# Altium schematic sheet MAX3232.SchDoc
size Letter; SheetNumber: 7; SheetTotal: 13
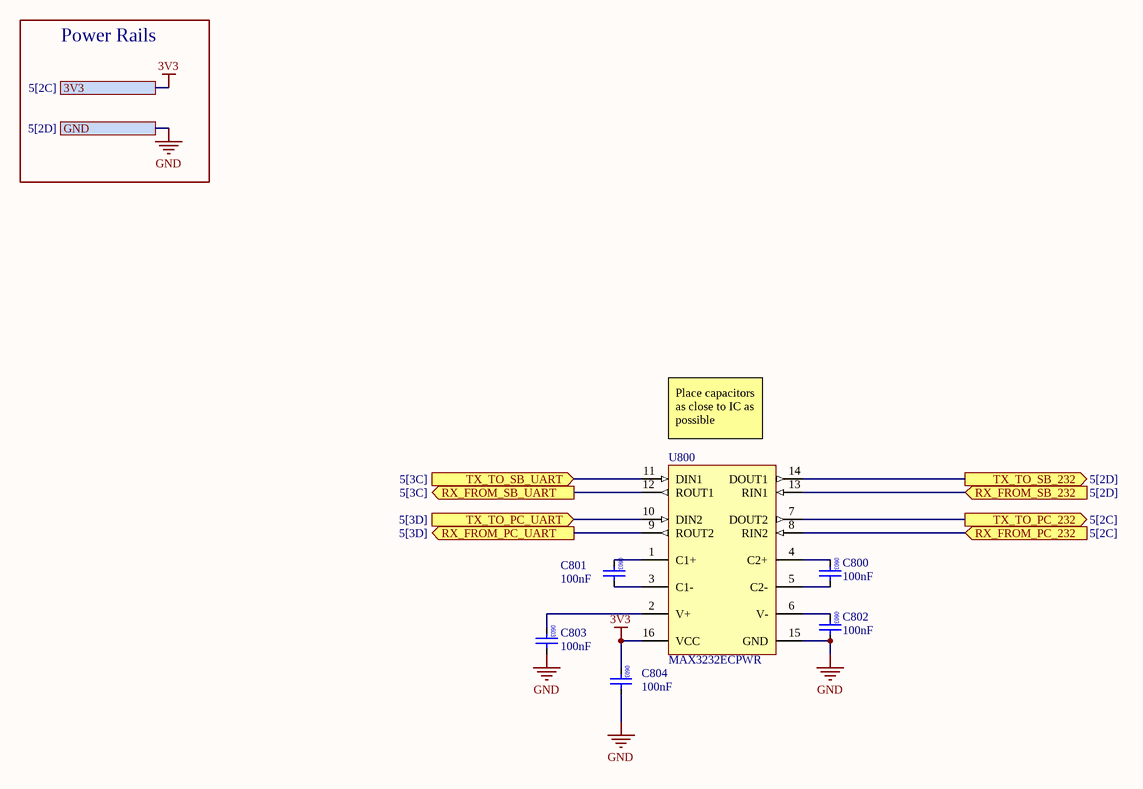
[diagram p0: MAX3232.SchDoc]

## Parts
C800  value 100nF  [0603 Capacitor Footprint]  (hidden comment: 0603 0.1uF 5% 50V)
C801  value 100nF  [0603 Capacitor Footprint]  (hidden comment: 0603 0.1uF 5% 50V)
C802  value 100nF  [0603 Capacitor Footprint]  (hidden comment: 0603 0.1uF 5% 50V)
C803  value 100nF  [0603 Capacitor Footprint]  (hidden comment: 0603 0.1uF 5% 50V)
C804  value 100nF  [0603 Capacitor Footprint]  (hidden comment: 0603 0.1uF 5% 50V)
U800  MAX3232ECPWR  [PW0016A_M]

## Ports
3V3 (see 5[2C]), GND (see 5[2D]), RX_FROM_PC_232 (in, see 5[2C]), RX_FROM_PC_UART (out, see 5[3D]), RX_FROM_SB_232 (in, see 5[2D]), RX_FROM_SB_UART (out, see 5[3C]), TX_TO_PC_232 (out, see 5[2C]), TX_TO_PC_UART (in, see 5[3D]), TX_TO_SB_232 (out, see 5[2D]), TX_TO_SB_UART (in, see 5[3C])

## Nets
3V3: C804.2 U800.16(VCC) ; port 3V3
GND: C802.1 C803.1 C804.1 U800.15(GND) ; port GND
RX_FROM_PC_232: U800.8(RIN2) ; port RX_FROM_PC_232
RX_FROM_PC_UART: U800.9(ROUT2) ; port RX_FROM_PC_UART
RX_FROM_SB_232: U800.13(RIN1) ; port RX_FROM_SB_232
RX_FROM_SB_UART: U800.12(ROUT1) ; port RX_FROM_SB_UART
TX_TO_PC_232: U800.7(DOUT2) ; port TX_TO_PC_232
TX_TO_PC_UART: U800.10(DIN2) ; port TX_TO_PC_UART
TX_TO_SB_232: U800.14(DOUT1) ; port TX_TO_SB_232
TX_TO_SB_UART: U800.11(DIN1) ; port TX_TO_SB_UART
NetC800_1: C800.1 U800.5(C2-)
NetC800_2: C800.2 U800.4(C2+)
NetC801_1: C801.1 U800.3(C1-)
NetC801_2: C801.2 U800.1(C1+)
NetC802_2: C802.2 U800.6(V-)
NetC803_2: C803.2 U800.2(V+)

## Notes on the sheet
- Power Rails
- (near U800) Place capacitors as close to IC as possible

## Library data of the parts
C800-C804 = CMP-001-00091-5: CAP CER 0.1UF 50V X7R 0603; Manufacturer Part Number: CC0603JPX7R9BB104; Capacitor Type: Ceramic; Case/Package: 0603; Tolerance: 5%; Voltage Rating: 50V; Mounting Technology: SF
U800 = CMP-0299-01479-2: 3-V to 5.5-V Multichannel RS-232 Line Driver / Receiver with ±15-kV IEC ESD Protection, 0 to 70 degC, 16-Pin TSSOP (PW), Green (RoHS & no Sb/Br); Supply Voltage(s)(V): 3.3 or 5.0; Receivers Per Package: 2; ESD HBM(kV): +/-15; IEC-61000-4-2 SUPPORT: TRUE; ICC(Max)(mA): 1; ComponentLink2Description: Datasheet; PackageVersion: revG, Feb-2011; ComponentLink3Description: Package Specification; DatasheetVersion: SLLS664A; Drivers Per Package: 2; PackageDescription: 16-Pin Plastic Thin Small Outline Package 5 x 4.4 mm Body ,0.65 mm Pitch; ComponentLink3URL: http://www.ti.com/litv/pdf/mpds361; ComponentLink1Description: Manufacturer URL; ComponentLink2URL: http://www.ti.com/general/docs/lit/getliterature.tsp?genericPartNumber=MAX3232E&fileType=pdf; PackageReference: PW0016A; RS-232: TRUE; SubFamily: RS-232; Single Supply: TRUE; ComponentLink1URL: www.ti.com